# EAGLE design RFID_escorna (EAGLE 6.5.0)
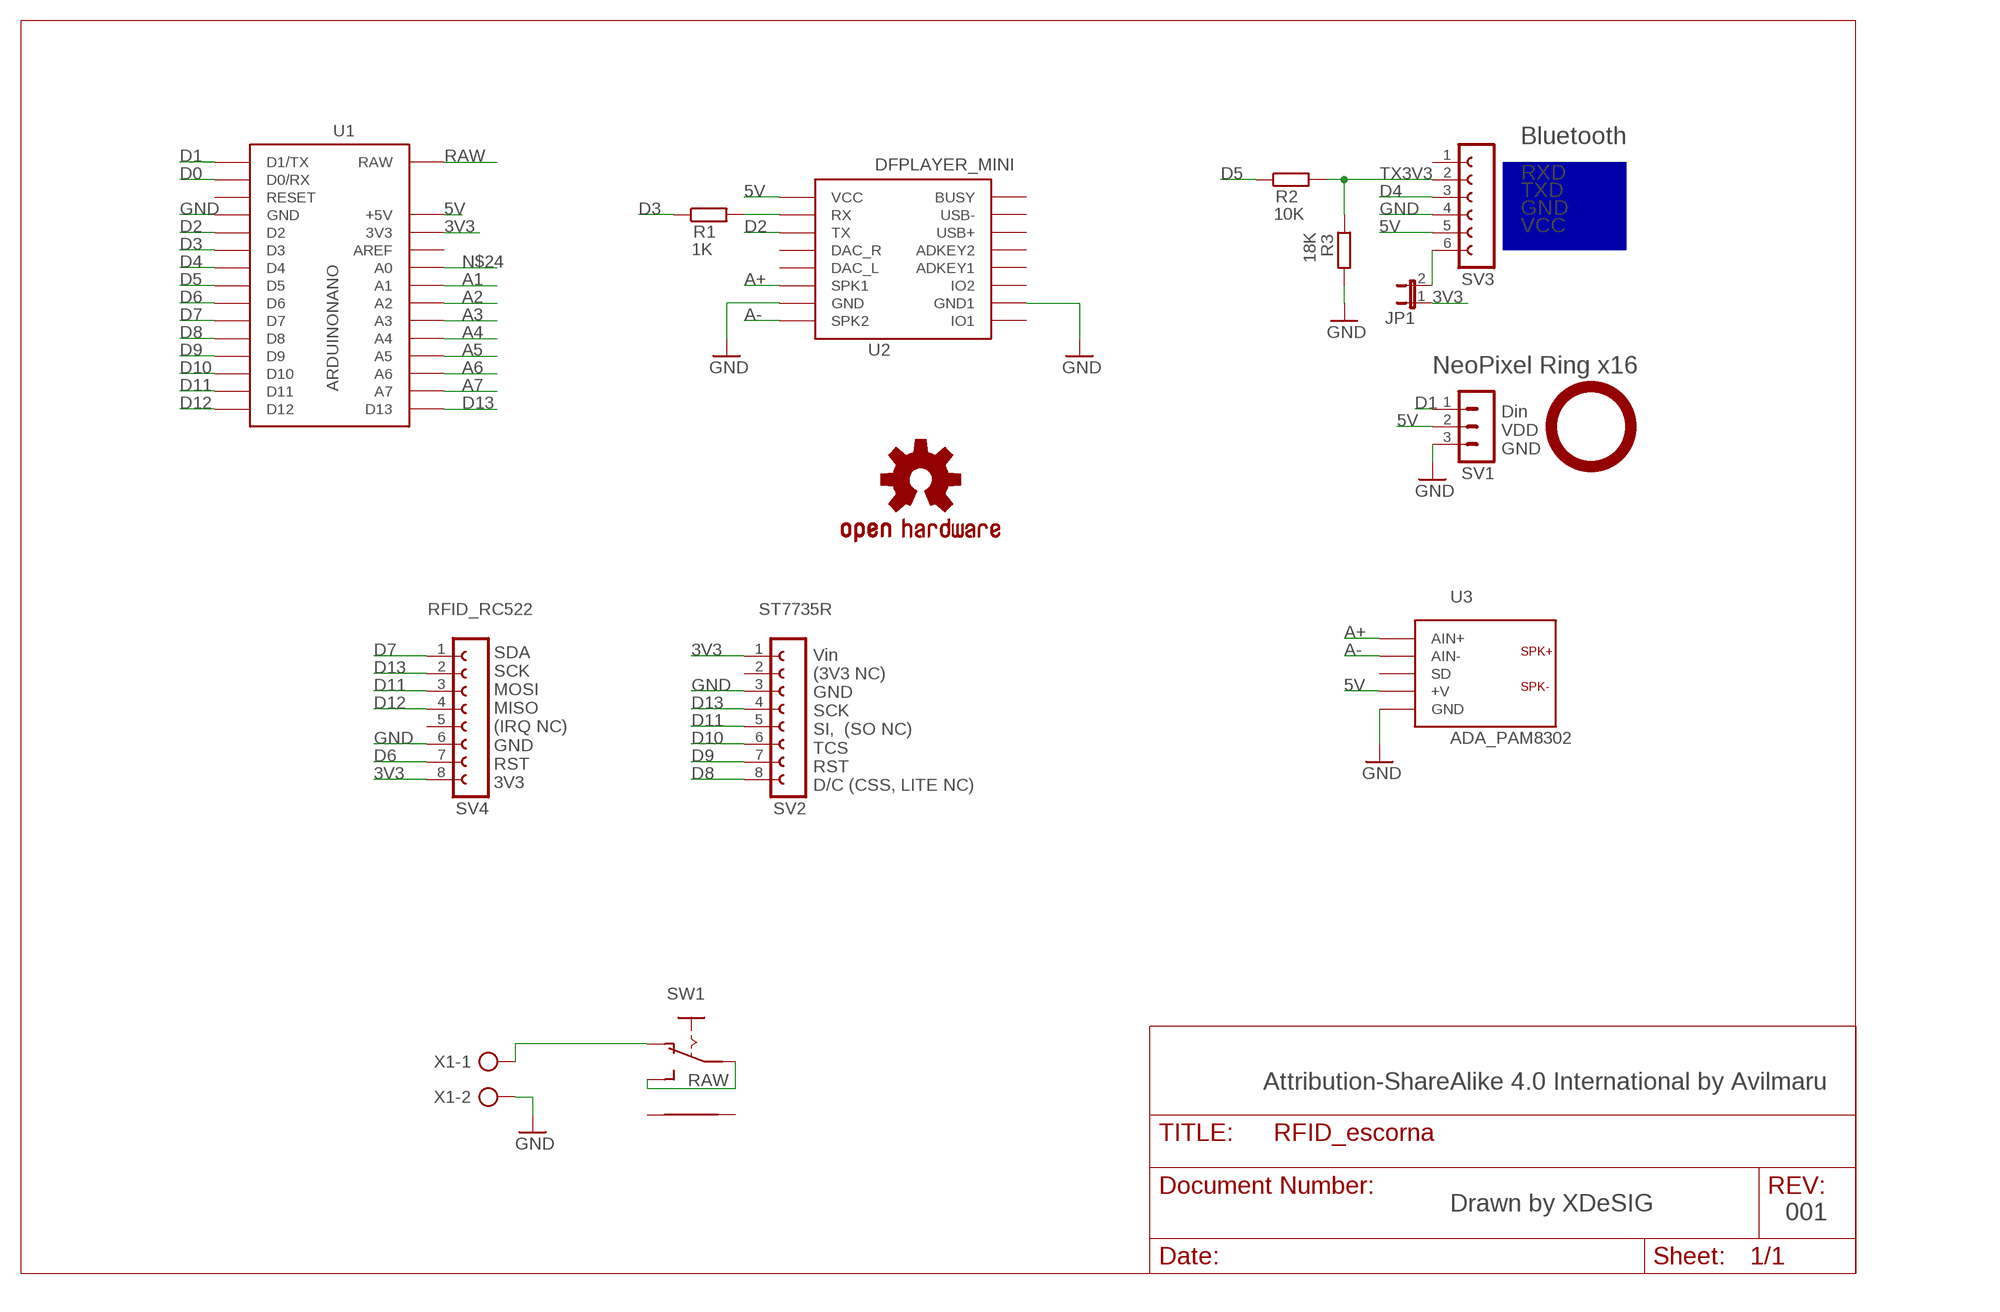
[diagram p0: schematic, sheet 1]

## Parts
JP1  JUMPER_JP1E  [JUMPER_JP1]
LOGO1  OSHW-LOGOS  [ESCORNA_LBRESCORNA_CPU_2_10_SPARKFUN-AESTHETICS_OSHW-LOGO-S]
R1  1K  R-EU_0204/7  [0204/7]
R2  10K  R-EU_0204/7  [0204/7]
R3  18K  R-EU_0204/7  [0204/7]
SV1  MA03-1  [MA03-1]
SV2  FE08-1  [FE08]
SV3  FE06-1  [FE06]
SV4  FE08-1  [FE08]
SW1  ESCORNA_ELIB_ESCORNA_SK12F14D  [ESCORNA_ELIB_ESCORNA_SK-12D07]
U1  ARDUINONANO  ARDUINONANONO_ICSP  [ARDUINO_NANO_NO_ICSP]
U2  DFPLAYER_MINI  [DFR0299]
U3  ADA_PAM8302  [ADA_PAM8320]
X1  AK500/2  [AK500/2]

## Nets
3V3: JP1.1 SV2.1 SV4.8 U1.3V3
5V: SV1.2 SV3.5 U1.5V(+5V) U2.P$1(VCC) U3.P$2(+V)
A1: U1.A1
A2: U1.A2
A3: U1.A3
A4: U1.A4
A5: U1.A5
A6: U1.A6
A7: U1.A7
A+: U2.P$6(SPK1) U3.P$5(AIN+)
A-: U2.P$8(SPK2) U3.P$4(AIN-)
D0: U1.D0/RX
D1: SV1.1 U1.D1/TX
D2: U1.D2 U2.P$3(TX)
D3: R1.1 U1.D3
D4: SV3.3 U1.D4
D5: R2.1 U1.D5
D6: SV4.7 U1.D6
D7: SV4.1 U1.D7
D8: SV2.8 U1.D8
D9: SV2.7 U1.D9
D10: SV2.6 U1.D10
D11: SV2.5 SV4.3 U1.D11
D12: SV4.4 U1.D12
D13: SV2.4 SV4.2 U1.D13
GND: R3.2 SV1.3 SV2.3 SV3.4 SV4.6 U1.GND U1.GND1(GND) U2.P$7(GND) U2.P$10(GND1) U3.P$1(GND) X1.2
N$1: JP1.2 SV3.6
N$2: SW1.P$2(O) X1.1
N$4: R1.2 U2.P$2(RX)
N$24: U1.A0
RAW: SW1.P$1(P) SW1.P$3(S) U1.RAW
TX3V3: R2.2 R3.1 SV3.2
Unconnected: SV2.2 SV3.1 SV4.5 SW1.P$4 SW1.P$5 U1.AREF U1.RESET U1.RST(RESET) U2.P$4(DAC_R) U2.P$5(DAC_L) U2.P$9(IO1) U2.P$11(IO2) U2.P$12(ADKEY1) U2.P$13(ADKEY2) U2.P$14(USB+) U2.P$15(USB-) U2.P$16(BUSY) U3.P$3(SD)

## Notes on the sheet
- Bluetooth
- RXD
- TXD
- GND
- VCC
- NeoPixel Ring x16
- Din
  VDD
  GND
- RFID_RC522 | ST7735R
- SDA
  SCK
  MOSI
  MISO
  (IRQ NC)
  GND
  RST
  3V3
- Vin 
  (3V3 NC)
  GND
  SCK
  SI,  (SO NC)
  TCS
  RST
  D/C (CSS, LITE NC)
- Attribution-ShareAlike 4.0 International by Avilmaru
- 001
- Drawn by XDeSIG

## Library data of the parts
JP1 = cervus2.100:JUMPER_JP1E: JUMPER
LOGO1 = Echidna_shield_LBR:OSHW-LOGO: Open Source Hardware Logo This logo indicates the piece of hardware it is found on incorporates a OSHW license and/or adheres to the definition of open source hardware found here: http://freedomdefined.org/OSHW
R1-R3 = rcl:R-EU_: RESISTOR, European symbol
SV1 = con-lstb:MA03-1: PIN HEADER; OC_FARNELL: unknown; OC_NEWARK: unknown
SV2 SV4 = con-lsta:FE08-1: FEMALE HEADER; OC_FARNELL: unknown; OC_NEWARK: unknown
SV3 = con-lsta:FE06-1: FEMALE HEADER; OC_FARNELL: unknown; OC_NEWARK: unknown
SW1 = escorna_LBREscorna_CPU_2_10:ESCORNA_ELIB_ESCORNA_SK12F14
U1 = arduino_nano:ARDUINONANO: The Arduino Nano is a small, complete, and breadboard-friendly board based on the ATmega328 (Arduino Nano 3.x) or ATmega168 (Arduino Nano 2.x). It has more or less the same functionality of the Arduino Duemilanove, but in a different package. It lacks only a DC power jack, and works with a Mini-B USB cable instead of a standard one. The Nano was designed and is being produced by Gravitech. Source: arduino.cc <http://arduino.cc/en/Main/arduinoBoardNano> Draw: xdesig.
U2 = modulos:DFPLAYER_MINI: The DFPlayer Mini MP3 Player For Arduino is a small and low price MP3 module with an simplified output directly to the speaker. The module can be used as a stand alone module with attached battery, speaker and push buttons or used in combination with an Arduino UNO or any other with RX/TX capabilities.
U3 = modulos:ADA_PAM8302
X1 = con-ptr500:AK500/2: CONNECTOR; OC_FARNELL: unknown; OC_NEWARK: unknown

## Net classes
0 default: width 0.254 mm, drill 0.61 mm, clearance 0.254 mm

## Board
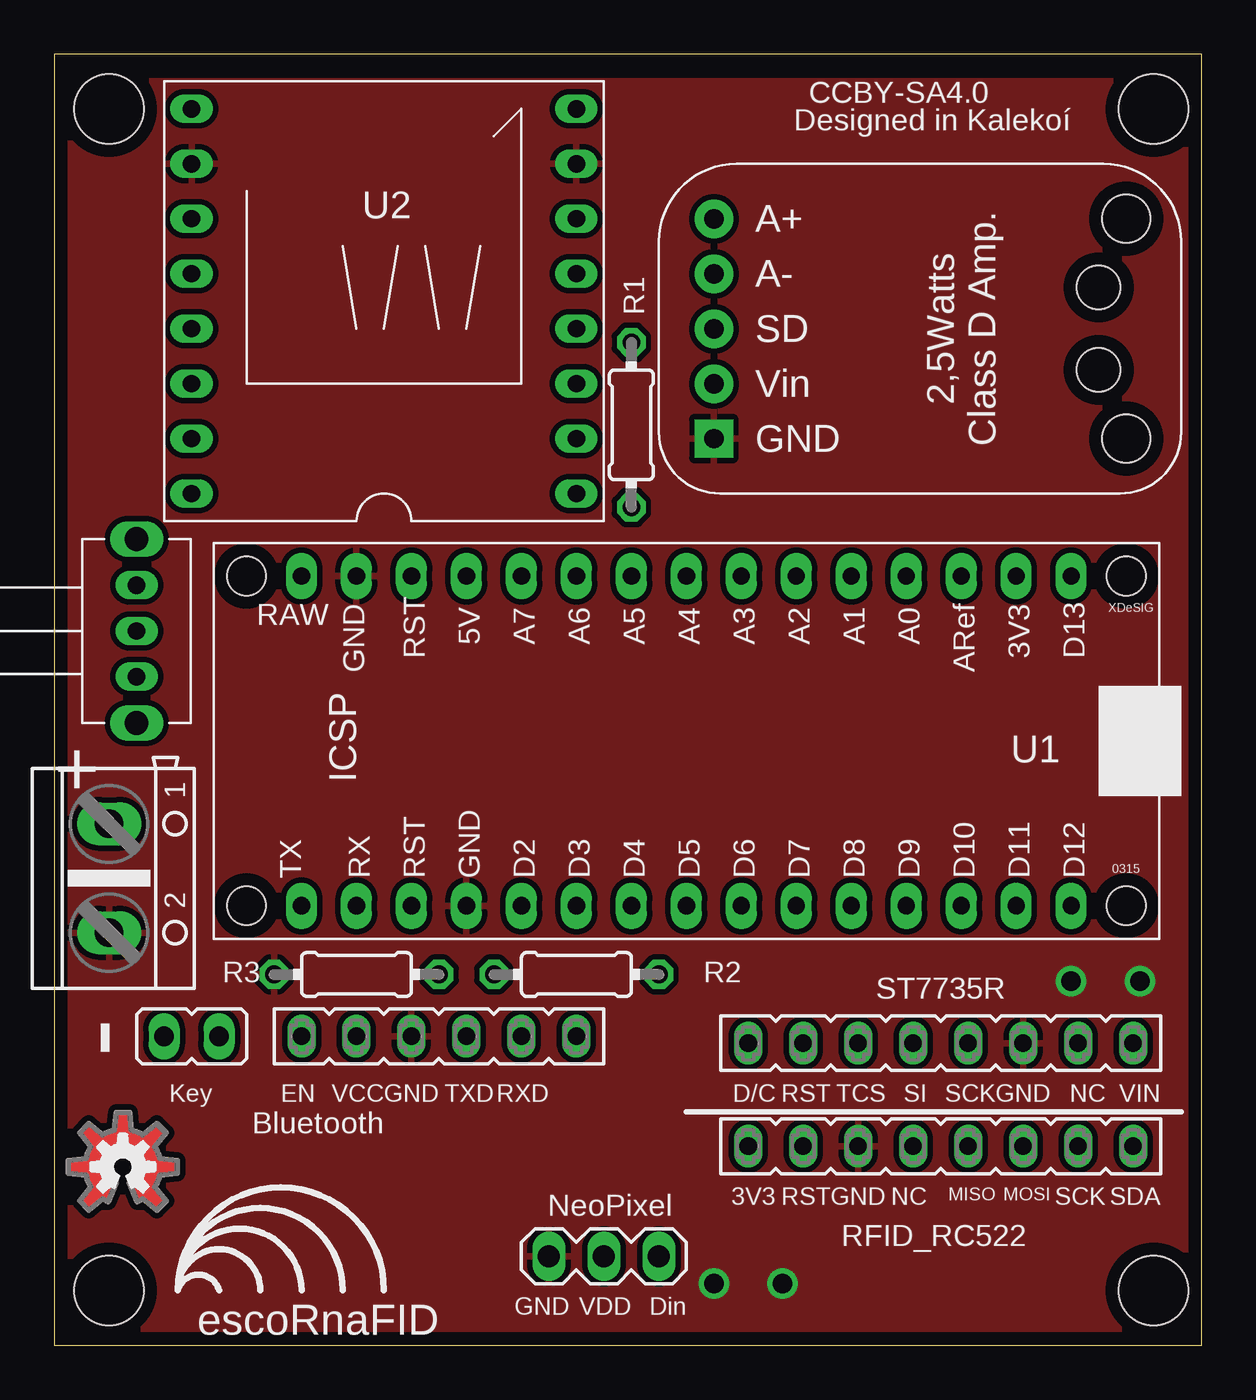
[diagram p1: board, top side]
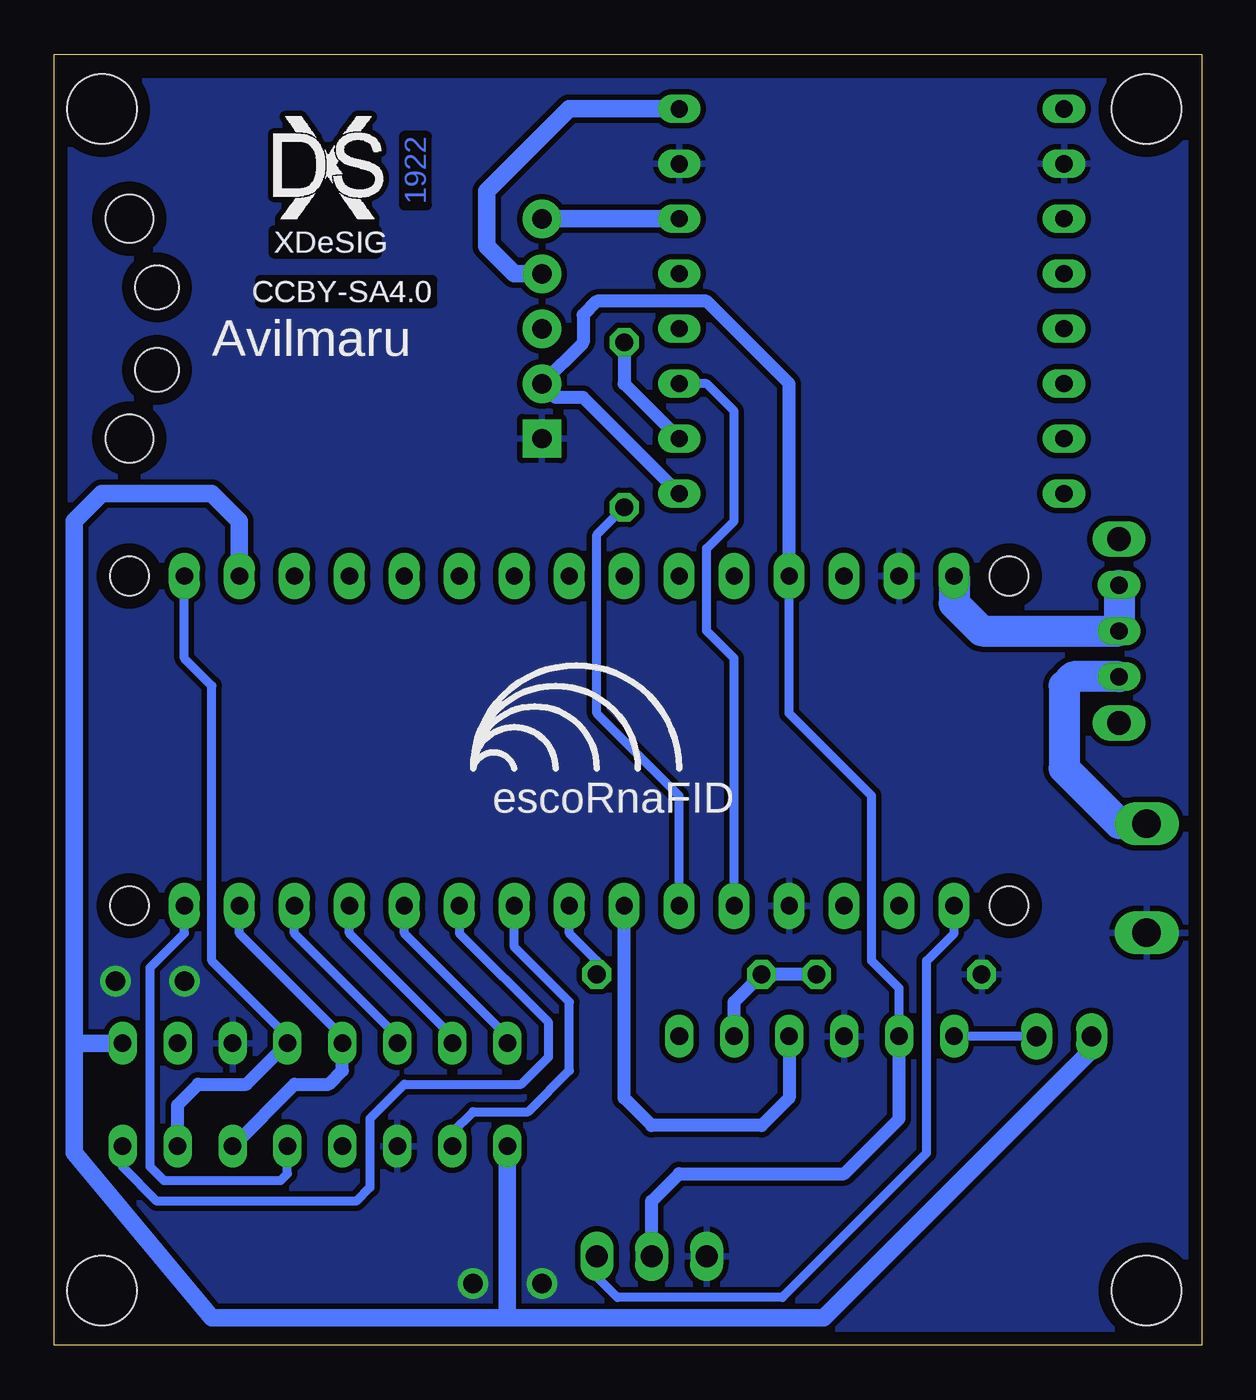
[diagram p2: board, bottom side, seen from below]

Size 53.01 x 59.68 mm. Coordinates in mm from the lower left corner, seen from the top.
Outline: 0,0 53.01,0 53.01,59.68 0,59.68 0,0
Copper layers (1*16): Top 0.035mm / dielectric 1.5mm / Bottom 0.035mm
Design rules "default": minimum track width 10mil, minimum drill 22mil, track to track 10mil, track to pad 10mil, pad to pad 8mil, via to via 12mil, smd to smd 8mil, copper to edge 24mil, drill to drill 12mil, minimum pad ring 10mil, minimum via ring 10mil, stop-mask expansion 2mil, vias tented up to drill 30mil, thermal gap 10mil
Holes 3.2 mm at 2.54,2.54 50.8,2.54 50.8,57.15 2.54,57.15

### Footprints (pad centres in the part's own frame; a part is rotated, then mirrored left to right if it is on the bottom)
JUMPER_JP1 = drill 0.914 long: 1 0,-1.27; 2 0,1.27
0204/7 = drill 0.813 octagon: 1 -3.81,0; 2 3.81,0
MA03-1 = drill 1.016 long: 1 -2.54,0; 2 0,0; 3 2.54,0
FE08 = drill 0.813 long: 1 -8.89,0; 2 -6.35,0; 3 -3.81,0; 4 -1.27,0; 5 1.27,0; 6 3.81,0; 7 6.35,0; 8 8.89,0
FE06 = drill 0.813 long: 1 -6.35,0; 2 -3.81,0; 3 -1.27,0; 4 1.27,0; 5 3.81,0; 6 6.35,0
ESCORNA_ELIB_ESCORNA_SK-12D07 = drill 0.8 long: P$1 0,0; P$2 2.115,0; P$3 -2.115,0 | drill 1.1 pad 1.27 long: P$4 -4.25,0; P$5 4.25,0
ARDUINO_NANO_NO_ICSP = drill 0.8 pad 1.422 long: 3V3 7.62,-15.24; 5V 7.62,10.16; A0 7.62,-10.16; A1 7.62,-7.62; A2 7.62,-5.08; A3 7.62,-2.54; A4 7.62,0; A5 7.62,2.54; A6 7.62,5.08; A7 7.62,7.62; AREF 7.62,-12.7; D0/RX -7.62,15.24; D1/TX -7.62,17.78; D2 -7.62,7.62; D3 -7.62,5.08; D4 -7.62,2.54; D5 -7.62,0; D6 -7.62,-2.54; D7 -7.62,-5.08; D8 -7.62,-7.62; D9 -7.62,-10.16; D10 -7.62,-12.7; D11 -7.62,-15.24; D12 -7.62,-17.78; D13 7.62,-17.78; GND -7.62,10.16; GND1 7.62,15.24; RAW 7.62,17.78; RESET -7.62,12.7; RST 7.62,12.7 | hole 1.778: -7.62,20.32; -7.62,-20.32; 7.62,-20.32; 7.62,20.32
DFR0299 = drill 0.8 long: P$1 -8.89,7.62; P$2 -8.89,5.08; P$3 -8.89,2.54; P$4 -8.89,0; P$5 -8.89,-2.54; P$6 -8.89,-5.08; P$7 -8.89,-7.62; P$8 -8.89,-10.16; P$9 8.89,-10.16; P$10 8.89,-7.62; P$11 8.89,-5.08; P$12 8.89,-2.54; P$13 8.89,0; P$14 8.89,2.54; P$15 8.89,5.08; P$16 8.89,7.62
ADA_PAM8320 = drill 0.9 pad 1.778 square: P$1 -7.62,-5.08 | drill 0.9 pad 1.778: P$2 -7.62,-2.54; P$3 -7.62,0; P$4 -7.62,2.54; P$5 -7.62,5.08 | hole 2: 10.16,-1.905; 10.16,1.905 | hole 2.2: 11.43,5.08; 11.43,-5.08
AK500/2 = drill 1.321 long: 1 -2.515,0; 2 2.515,0

### Placement (x,y rotation side)
JP1  6.35,14.29 270 top
LOGO1  3.17,8.26 0 top
R1  26.67,42.55 90 top
R2  24.13,17.14 180 top
R3  13.97,17.14 180 top
SV1  25.4,4.13 180 top
SV2  40.96,13.97 180 top
SV3  17.78,14.29 180 top
SV4  40.96,9.21 180 top
SW1  3.81,33.02 270 top
U1  29.21,27.94 90 top
U2  15.24,46.99 180 top
U3  38.1,46.99 0 top
U$1  [XDESIG_CU]  42.86,52.07 0 bottom
U$2  [OSHWLOGO_TOP_0.2]  3.17,8.26 0 top
U$5  [XDESIG]  42.86,52.07 0 bottom
X1  2.54,21.59 270 top

### Tracks (layer width: path | path; a pad name or v marks a point on that pad's centre or on a via)
3V3
  Bottom 0.813: 32.07,1.27 45.72,1.27 52.07,8.89 52.07,13.97 | SV4.8 32.07,1.27 | 52.07,13.97 52.07,38.1 50.8,39.37 45.72,39.37 44.45,38.1 U1.3V3 | SV2.1 52.07,13.97 | JP1.1 5.08,13.65 16.35,2.38 16.83,1.91 17.46,1.27 32.07,1.27
5V
  Bottom 0.406: 19.05,31.75 U1.5V 19.05,29.21 15.24,25.4 15.24,17.78 13.97,16.51 SV3.5
  Bottom 0.61: U1.5V 19.05,44.45 22.86,48.26 27.94,48.26 28.57,47.62 28.57,46.35 U3.P$2 29.84,43.81 28.57,43.81 U2.P$1 | SV3.5 13.97,10.48 16.51,7.94 24.13,7.94 25.4,6.67 SV1.2
A+
  Bottom 0.813: U2.P$6 U3.P$5
A-
  Bottom 0.813: U2.P$8 29.21,57.15 33.02,53.34 33.02,50.8 31.75,49.53 U3.P$4
D1
  Bottom 0.406: U1.D1/TX 11.43,19.05 12.7,17.78 12.7,8.89 19.37,2.22 26.99,2.22 27.94,3.17 SV1.1
D2
  Bottom 0.406: U1.D2 21.59,31.75 22.86,33.02 22.86,36.83 21.59,38.1 21.59,43.18 22.86,44.45 U2.P$3
D3
  Bottom 0.406: U1.D3 24.13,25.4 27.94,29.21 27.94,37.47 R1.1
D4
  Bottom 0.61: SV3.3 19.05,11.43 20.32,10.16 25.4,10.16 26.67,11.43 U1.D4
D5
  Bottom 0.406: R2.1 27.94,17.78 29.21,19.05 U1.D5
D6
  Bottom 0.406: SV4.7 34.61,9.84 33.66,10.79 31.11,10.79 29.21,12.7 29.21,15.88 31.75,18.41 U1.D6
D7
  Bottom 0.406: U1.D7 34.29,19.05 30.16,14.92 30.16,13.34 31.43,12.06 36.83,12.06 38.42,10.48 38.42,7.3 39.05,6.67 48.26,6.67 49.85,8.26 SV4.1
D8
  Bottom 0.406: SV2.8 32.07,14.29 36.83,19.05 U1.D8
D9
  Bottom 0.406: SV2.7 34.61,14.29 39.37,19.05 U1.D9
D10
  Bottom 0.406: SV2.6 37.15,14.29 41.91,19.05 U1.D10
D11
  Bottom 0.406: SV2.5 39.69,14.29 44.45,19.05 U1.D11
  Bottom 0.61: SV4.3 41.91,12.06 40.32,12.06 39.69,12.7 SV2.5
D12
  Bottom 0.406: U1.D12 46.99,19.05 48.58,17.46 48.58,8.26 47.94,7.62 42.55,7.62 42.23,7.94 SV4.4
D13
  Bottom 0.406: U1.D13 46.99,31.75 45.72,30.48 45.72,17.78 42.23,14.29 SV2.4
  Bottom 0.61: SV4.2 47.31,11.11 46.35,12.06 44.13,12.06 SV2.4
GND  (via drill 0.9)
  other vias: 30.48,2.86 33.66,2.86 46.99,16.83 50.16,16.83
  pour Bottom: 0,58.42 53.34,58.42 53.34,0 0,0
  pour Top: 0,58.42 53.34,58.42 53.34,0 0,0
N$1
  Bottom 0.406: JP1.2 SV3.6
N$2
  Bottom 1.422: SW1.P$2 5.92,30.91 6.35,30.48 6.35,26.67 3.79,24.11 X1.1
N$4
  Bottom 0.61: R1.2 26.67,44.45 U2.P$2
RAW
  Bottom 1.422: U1.RAW 11.43,34.29 10.16,33.02 SW1.P$1 SW1.P$3
TX3V3
  Bottom 0.61: R3.1 R2.2 21.59,15.88 SV3.2

### Text on the board
Bottom: 1922 | XDeSIG | CCBY-SA4.0
tPlace: CCBY-SA4.0 | Designed in Kalekoí | + | ST7735R | - | Key | EN | VCC | GND | TXD | RXD | D/C | RST | TCS | SI | SCK | GND | NC | VIN | Bluetooth | NeoPixel | 3V3 | RST | GND | NC | MISO | MOSI | SCK | SDA | RFID_RC522 | escoRnaFID | GND | VDD | Din
bPlace: XDeSIG | CCBY-SA4.0 | Avilmaru | escoRnaFID